# EAGLE schematic untitled (EAGLE 7.7.0)
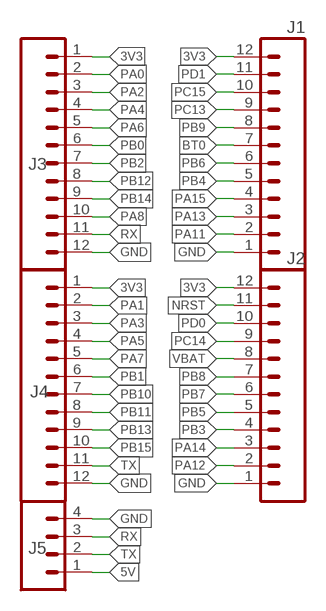
[diagram p0: schematic, sheet 1]

## Parts
J1  M12PTH  [1X12]
J2  M12PTH  [1X12]
J3  M12PTH  [1X12]
J4  M12PTH  [1X12]
J5  M04PTH  [1X04]

## Nets
3V3: J1.12 J2.12 J3.1 J4.1
5V: J5.1
BT0: J1.7
GND: J1.1 J2.1 J3.12 J4.12 J5.4
NRST: J2.11
PA0: J3.2
PA1: J4.2
PA2: J3.3
PA3: J4.3
PA4: J3.4
PA5: J4.4
PA6: J3.5
PA7: J4.5
PA8: J3.10
PA11: J1.2
PA12: J2.2
PA13: J1.3
PA14: J2.3
PA15: J1.4
PB0: J3.6
PB1: J4.6
PB2: J3.7
PB3: J2.4
PB4: J1.5
PB5: J2.5
PB6: J1.6
PB7: J2.6
PB8: J2.7
PB9: J1.8
PB10: J4.7
PB11: J4.8
PB12: J3.8
PB13: J4.9
PB14: J3.9
PB15: J4.10
PC13: J1.9
PC14: J2.9
PC15: J1.10
PD0: J2.10
PD1: J1.11
RX: J3.11 J5.3
TX: J4.11 J5.2
VBAT: J2.8

## Library data of the parts
J1-J4 = SparkFun-Connectors:M12: Header 12 Standard 12-pin 0.1" header. Use with straight break away headers (SKU : PRT-00116), right angle break away headers (PRT-00553), swiss pins (PRT-00743), machine pins (PRT-00117), and female headers (PRT-00115).
J5 = SparkFun-Connectors:M04: Header 4 Standard 4-pin 0.1" header. Use with straight break away headers (SKU : PRT-00116), right angle break away headers (PRT-00553), swiss pins (PRT-00743), machine pins (PRT-00117), and female headers (PRT-00115). Molex polarized connector foot print use with SKU : PRT-08231 with associated crimp pins and housings. 1MM SMD Version SKU: PRT-10208; PROD_ID: CONN-09696